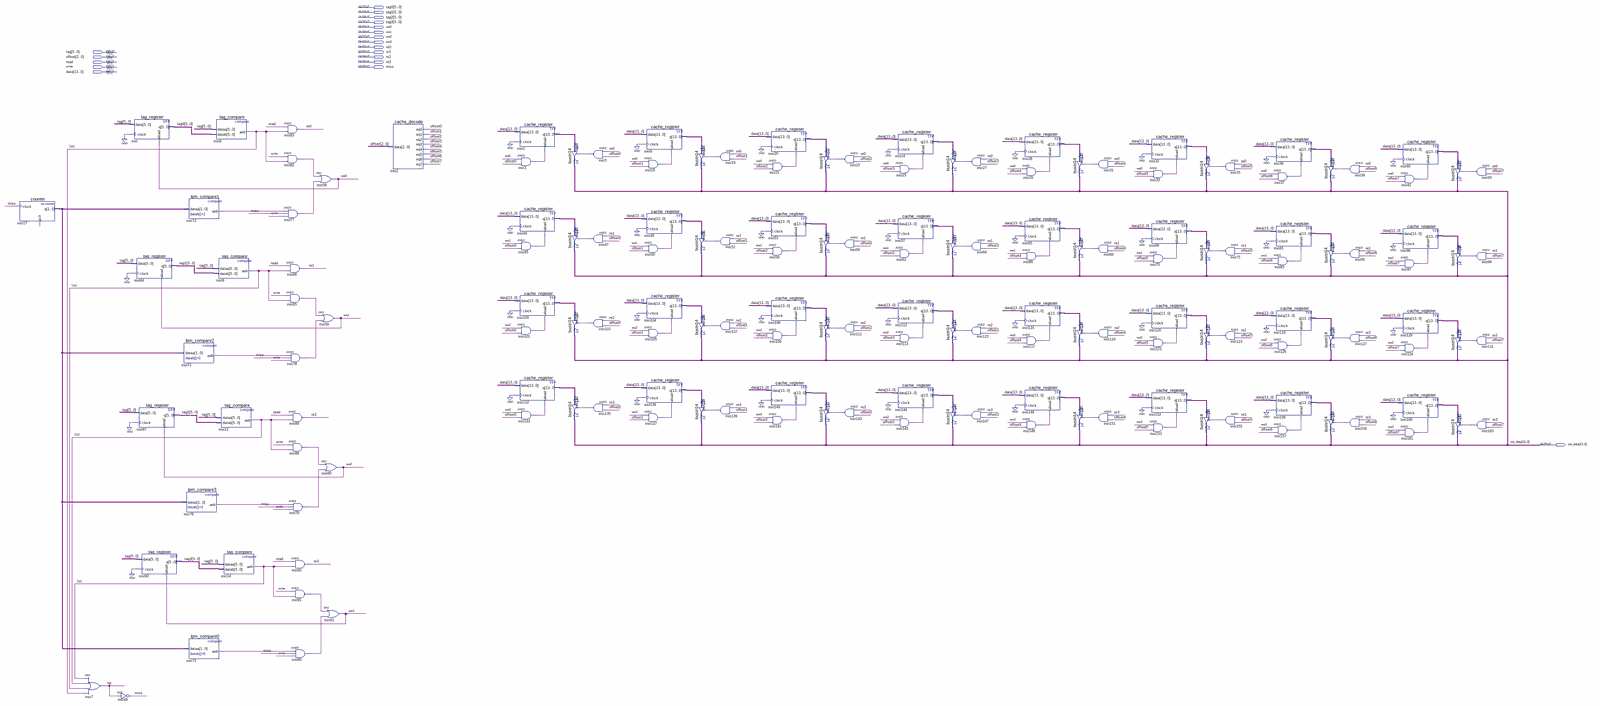
[diagram p0: schematic sheet, whole]
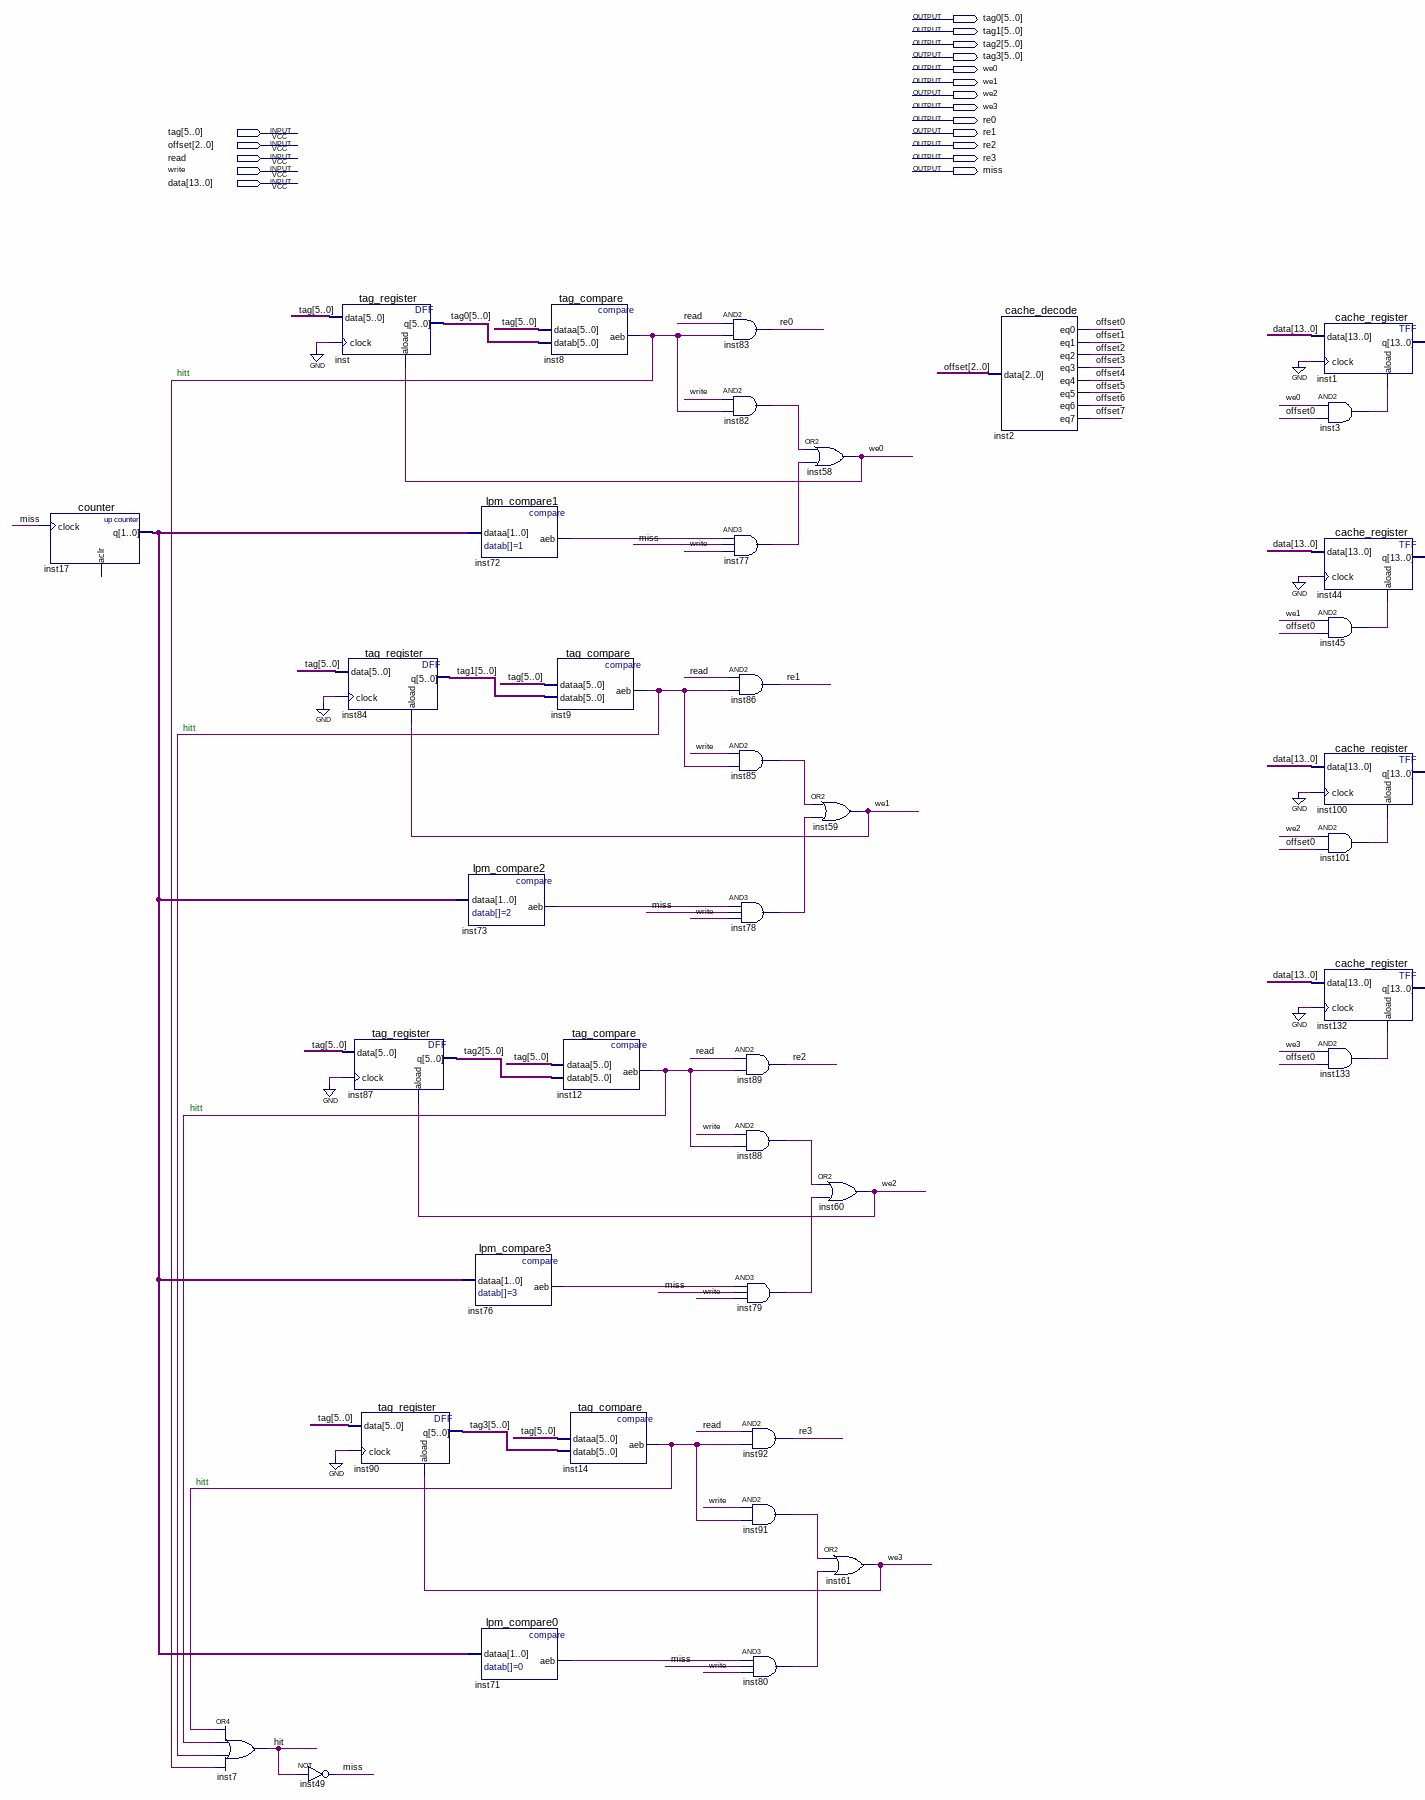
[diagram p1: schematic sheet, left part]
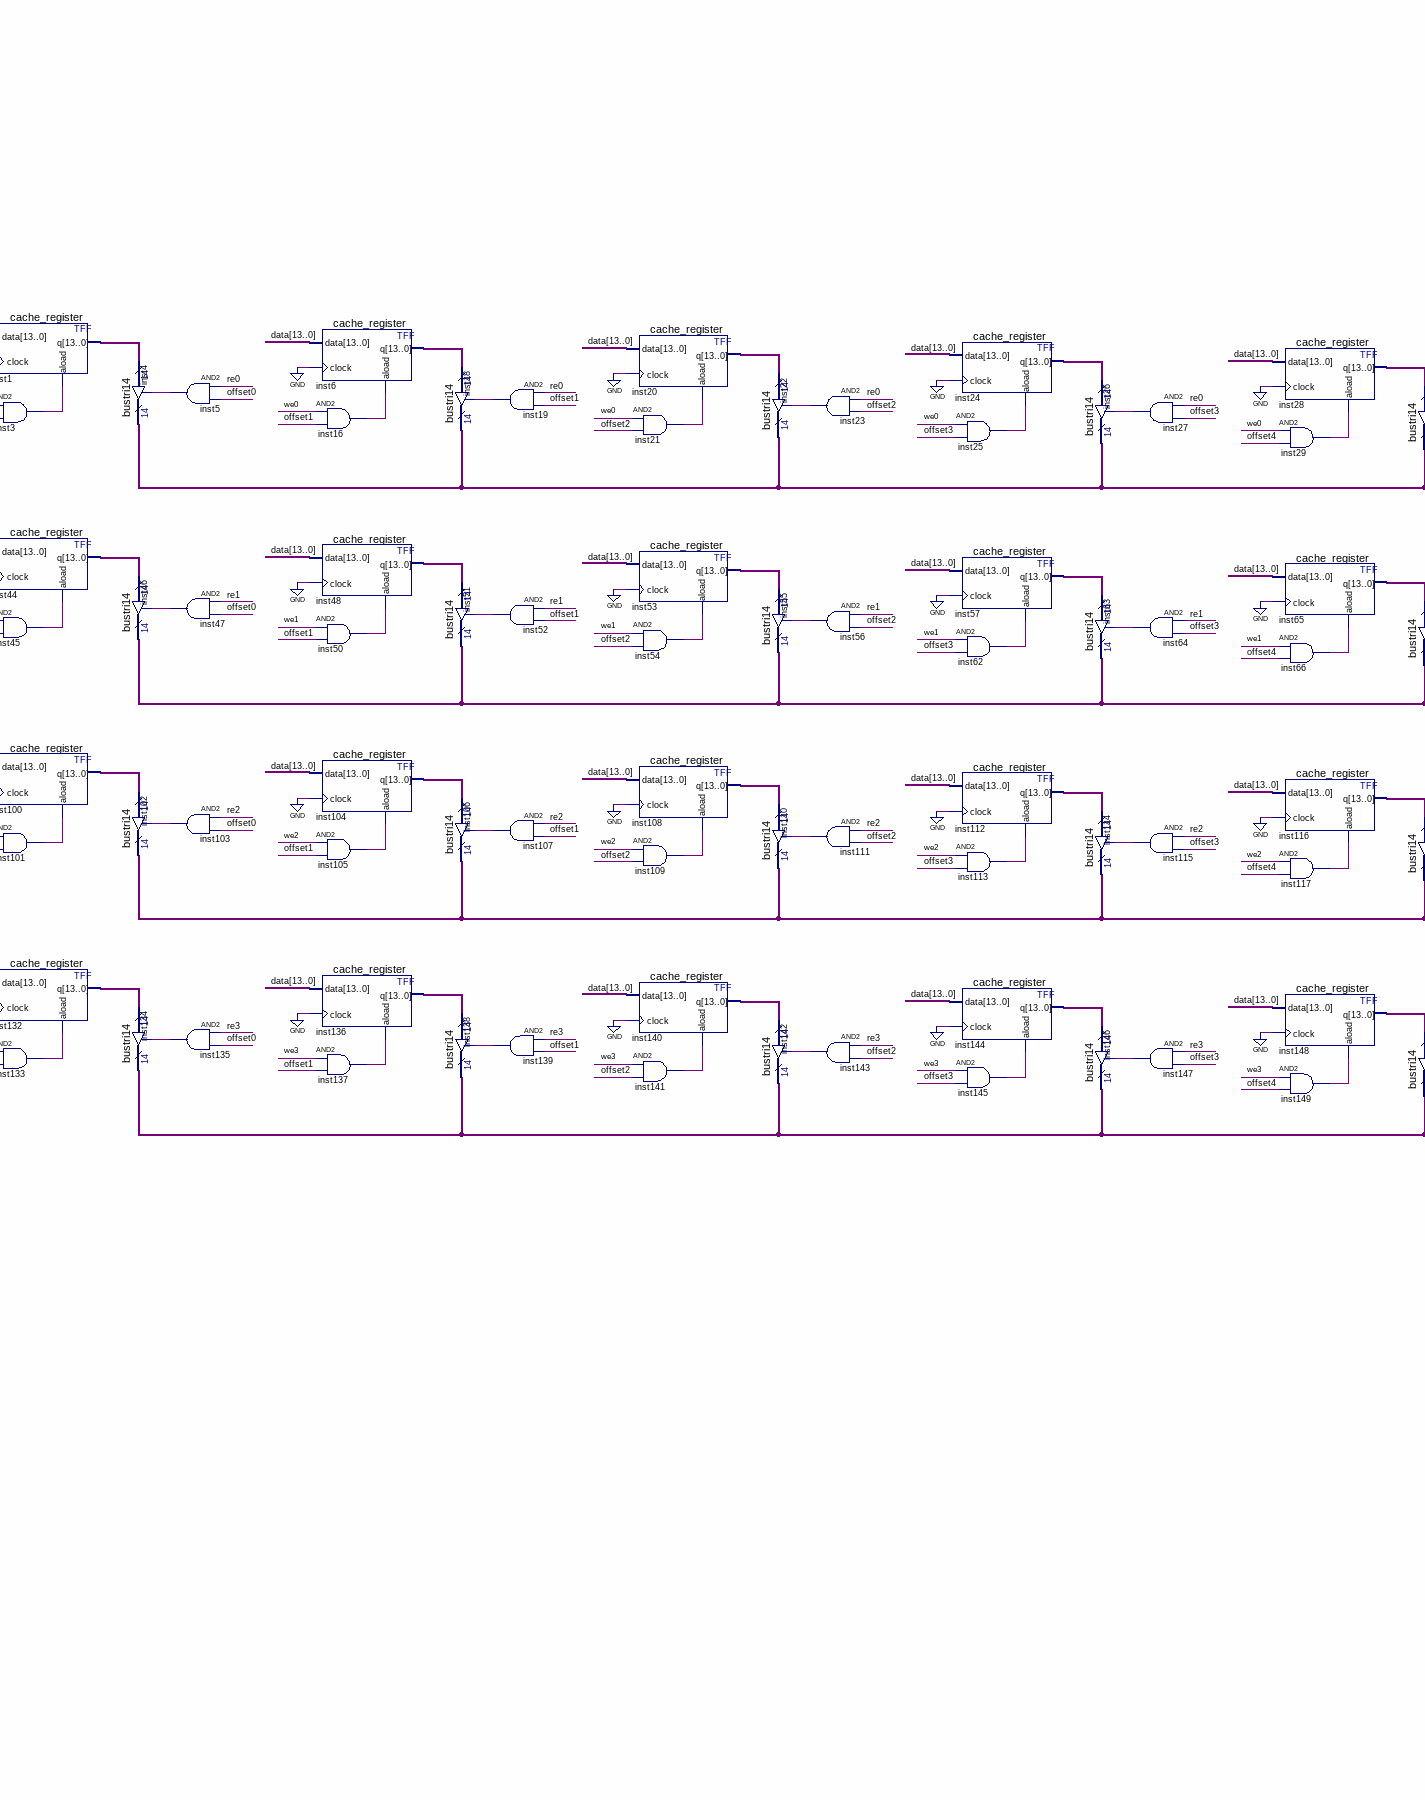
[diagram p2: schematic sheet, centre part]
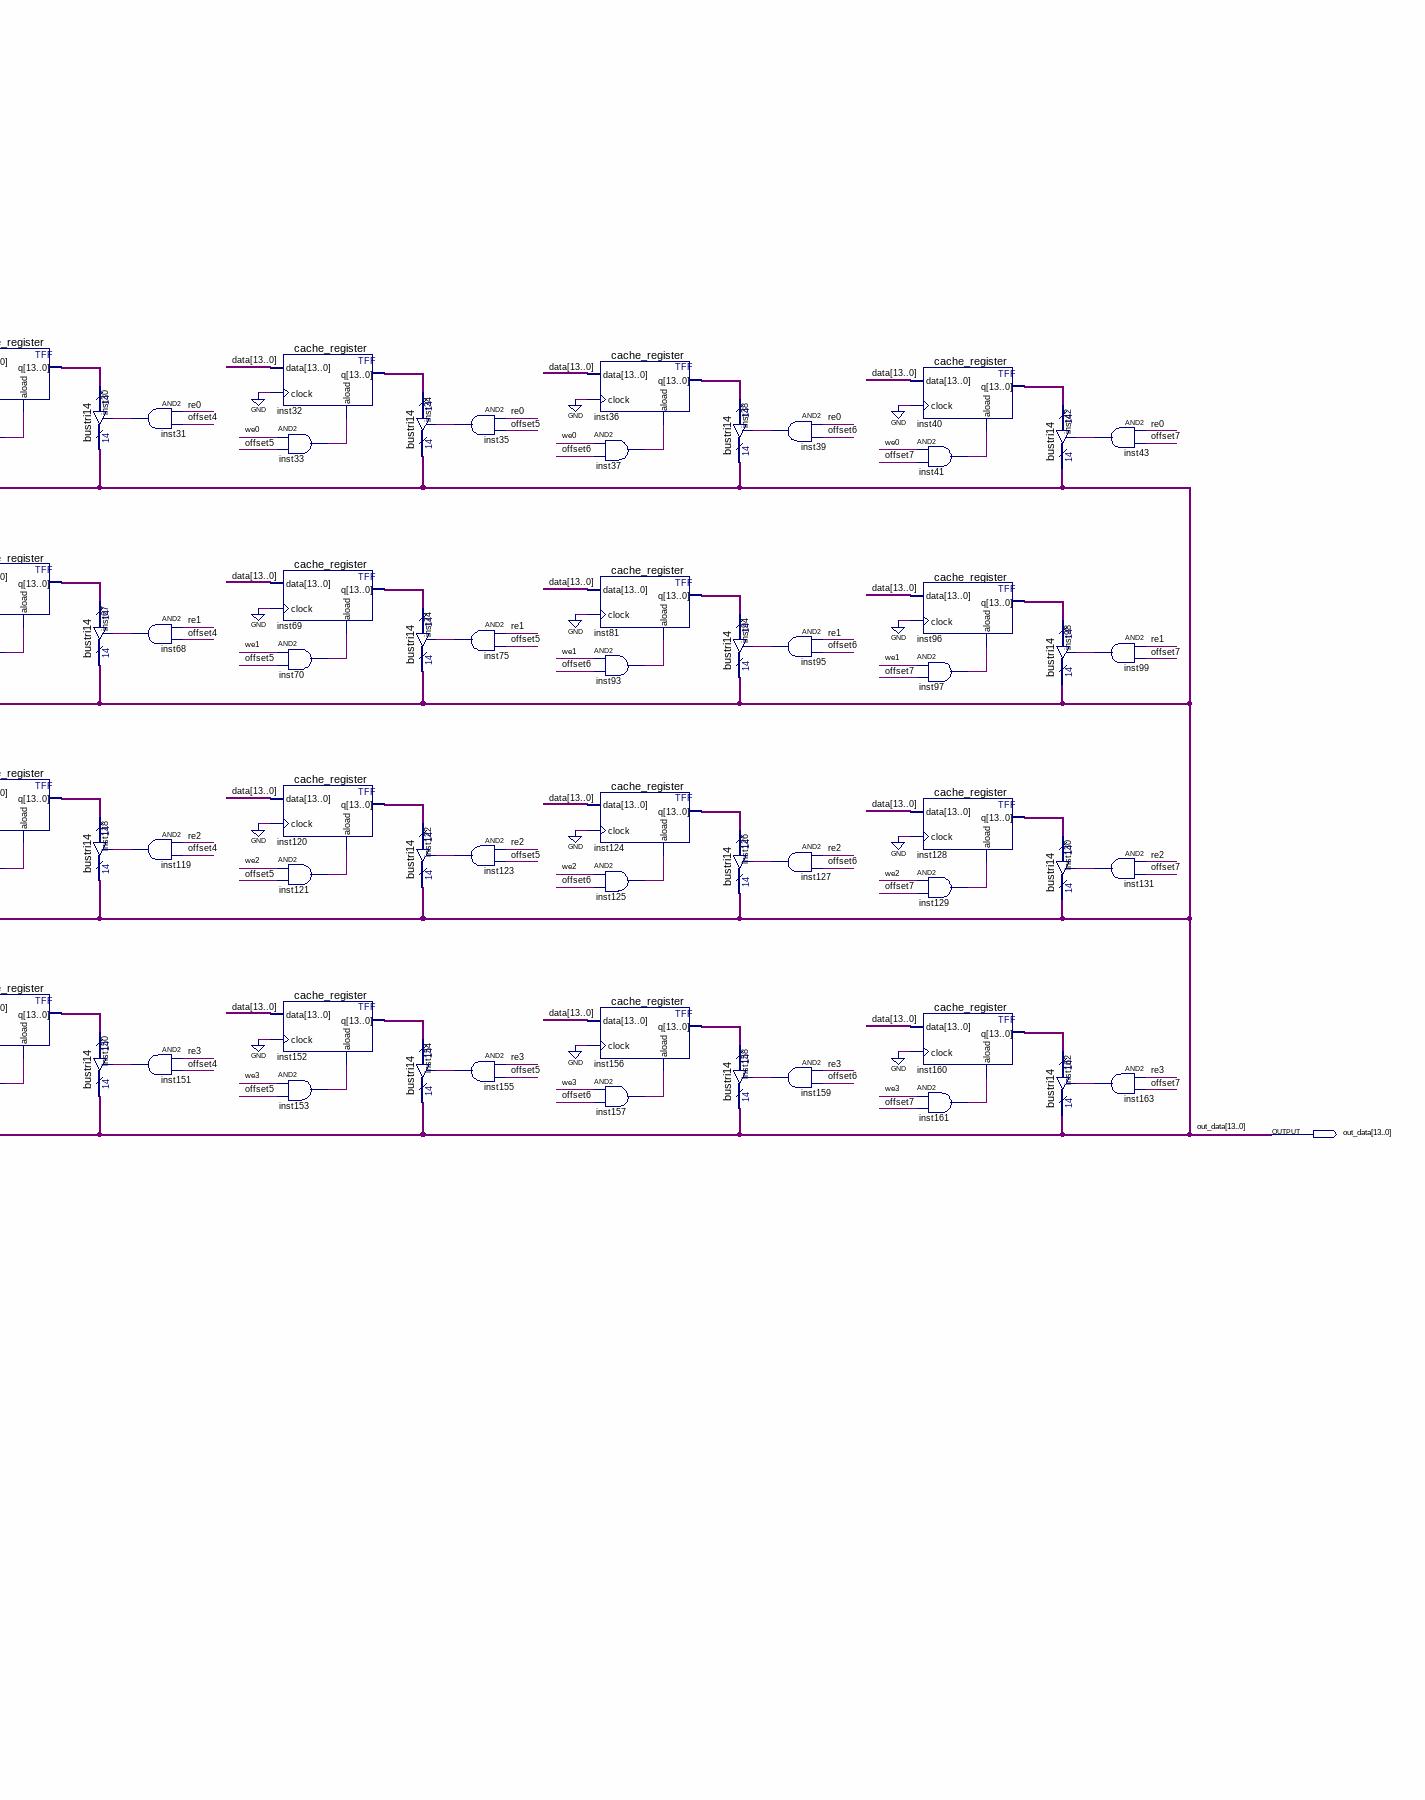
[diagram p3: schematic sheet, right part]
// Quartus schematic cachMem.bdf as structural Verilog: 160 symbols, 19 pins
module cachMem (
  input  [5:0] tag,
  input  [2:0] offset,
  input  read,
  input  write,
  input  [13:0] data,
  output [5:0] tag0,
  output [5:0] tag1,
  output [5:0] tag2,
  output [5:0] tag3,
  output we0,
  output we1,
  output we2,
  output we3,
  output re0,
  output re1,
  output re2,
  output re3,
  output miss,
  output [13:0] out_data
);

  wire hit, inst3_out, inst5_out, inst8_aeb, inst9_aeb, inst12_aeb, inst14_aeb, inst16_out, inst19_out,
       inst21_out, inst23_out, inst25_out, inst27_out, inst29_out, inst31_out, inst33_out, inst35_out,
       inst37_out, inst39_out, inst41_out, inst43_out, inst45_out, inst47_out, inst50_out, inst52_out,
       inst54_out, inst56_out, inst62_out, inst64_out, inst66_out, inst68_out, inst70_out, inst71_aeb,
       inst72_aeb, inst73_aeb, inst75_out, inst76_aeb, inst77_out, inst78_out, inst79_out, inst80_out,
       inst82_out, inst85_out, inst88_out, inst91_out, inst93_out, inst95_out, inst97_out, inst99_out,
       inst101_out, inst103_out, inst105_out, inst107_out, inst109_out, inst111_out, inst113_out,
       inst115_out, inst117_out, inst119_out, inst121_out, inst123_out, inst125_out, inst127_out,
       inst129_out, inst131_out, inst133_out, inst135_out, inst137_out, inst139_out, inst141_out,
       inst143_out, inst145_out, inst147_out, inst149_out, inst151_out, inst153_out, inst155_out,
       inst157_out, inst159_out, inst161_out, inst163_out, offset3, offset4, offset5, offset6, offset7;
  wire [1:0] inst17_q;
  wire [13:0] inst1_q, inst6_q, inst20_q, inst24_q, inst28_q, inst32_q, inst36_q, inst40_q, inst44_q,
       inst48_q, inst53_q, inst57_q, inst65_q, inst69_q, inst81_q, inst96_q, inst100_q, inst104_q, inst108_q,
       inst112_q, inst116_q, inst120_q, inst124_q, inst128_q, inst132_q, inst136_q, inst140_q, inst144_q,
       inst148_q, inst152_q, inst156_q, inst160_q;

  counter inst17 (.clock(miss), .q(inst17_q));  // open: aclr
  or inst7 (hit, inst14_aeb, inst12_aeb, inst9_aeb, inst8_aeb);
  tag_register inst (.data(tag), .clock(1'b0), .aload(we0), .q(tag0));
  tag_register inst84 (.data(tag), .clock(1'b0), .aload(we1), .q(tag1));
  not inst49 (miss, hit);
  tag_register inst87 (.data(tag), .clock(1'b0), .aload(we2), .q(tag2));
  tag_register inst90 (.data(tag), .clock(1'b0), .aload(we3), .q(tag3));
  lpm_compare1 inst72 (.dataa(inst17_q), .aeb(inst72_aeb));
  lpm_compare2 inst73 (.dataa(inst17_q), .aeb(inst73_aeb));
  lpm_compare3 inst76 (.dataa(inst17_q), .aeb(inst76_aeb));
  lpm_compare0 inst71 (.dataa(inst17_q), .aeb(inst71_aeb));
  tag_compare inst8 (.dataa(tag), .datab(tag0), .aeb(inst8_aeb));
  tag_compare inst9 (.dataa(tag), .datab(tag1), .aeb(inst9_aeb));
  tag_compare inst12 (.dataa(tag), .datab(tag2), .aeb(inst12_aeb));
  tag_compare inst14 (.dataa(tag), .datab(tag3), .aeb(inst14_aeb));
  and inst83 (re0, read, inst8_aeb);
  and inst82 (inst82_out, write, inst8_aeb);
  and inst77 (inst77_out, inst72_aeb, miss, write);
  and inst86 (re1, read, inst9_aeb);
  and inst85 (inst85_out, write, inst9_aeb);
  and inst78 (inst78_out, inst73_aeb, miss, write);
  and inst89 (re2, read, inst12_aeb);
  and inst88 (inst88_out, write, inst12_aeb);
  and inst79 (inst79_out, inst76_aeb, miss, write);
  and inst92 (re3, read, inst14_aeb);
  and inst91 (inst91_out, write, inst14_aeb);
  and inst80 (inst80_out, inst71_aeb, miss, write);
  or inst58 (we0, inst82_out, inst77_out);
  or inst59 (we1, inst85_out, inst78_out);
  or inst60 (we2, inst88_out, inst79_out);
  or inst61 (we3, inst91_out, inst80_out);
  cache_decode inst2 (
    .data(offset), .eq0(offset[0]), .eq1(offset[1]), .eq2(offset[2]), .eq3(offset3), .eq4(offset4),
    .eq5(offset5), .eq6(offset6), .eq7(offset7));
  cache_register inst1 (.data(data), .clock(1'b0), .aload(inst3_out), .q(inst1_q));
  and inst3 (inst3_out, we0, offset[0]);
  cache_register inst44 (.data(data), .clock(1'b0), .aload(inst45_out), .q(inst44_q));
  and inst45 (inst45_out, we1, offset[0]);
  cache_register inst100 (.data(data), .clock(1'b0), .aload(inst101_out), .q(inst100_q));
  and inst101 (inst101_out, we2, offset[0]);
  cache_register inst132 (.data(data), .clock(1'b0), .aload(inst133_out), .q(inst132_q));
  and inst133 (inst133_out, we3, offset[0]);
  bustri14 inst4 (.enabledt(inst5_out), .data(inst1_q), .tridata(out_data));
  bustri14 inst46 (.enabledt(inst47_out), .data(inst44_q), .tridata(out_data));
  bustri14 inst102 (.enabledt(inst103_out), .data(inst100_q), .tridata(out_data));
  bustri14 inst134 (.enabledt(inst135_out), .data(inst132_q), .tridata(out_data));
  and inst5 (inst5_out, re0, offset[0]);
  and inst47 (inst47_out, re1, offset[0]);
  and inst103 (inst103_out, re2, offset[0]);
  and inst135 (inst135_out, re3, offset[0]);
  cache_register inst6 (.data(data), .clock(1'b0), .aload(inst16_out), .q(inst6_q));
  and inst16 (inst16_out, we0, offset[1]);
  cache_register inst48 (.data(data), .clock(1'b0), .aload(inst50_out), .q(inst48_q));
  and inst50 (inst50_out, we1, offset[1]);
  cache_register inst104 (.data(data), .clock(1'b0), .aload(inst105_out), .q(inst104_q));
  and inst105 (inst105_out, we2, offset[1]);
  cache_register inst136 (.data(data), .clock(1'b0), .aload(inst137_out), .q(inst136_q));
  and inst137 (inst137_out, we3, offset[1]);
  bustri14 inst18 (.enabledt(inst19_out), .data(inst6_q), .tridata(out_data));
  bustri14 inst51 (.enabledt(inst52_out), .data(inst48_q), .tridata(out_data));
  bustri14 inst106 (.enabledt(inst107_out), .data(inst104_q), .tridata(out_data));
  bustri14 inst138 (.enabledt(inst139_out), .data(inst136_q), .tridata(out_data));
  and inst19 (inst19_out, re0, offset[1]);
  and inst52 (inst52_out, re1, offset[1]);
  and inst107 (inst107_out, re2, offset[1]);
  and inst139 (inst139_out, re3, offset[1]);
  cache_register inst20 (.data(data), .clock(1'b0), .aload(inst21_out), .q(inst20_q));
  and inst21 (inst21_out, we0, offset[2]);
  cache_register inst53 (.data(data), .clock(1'b0), .aload(inst54_out), .q(inst53_q));
  and inst54 (inst54_out, we1, offset[2]);
  cache_register inst108 (.data(data), .clock(1'b0), .aload(inst109_out), .q(inst108_q));
  and inst109 (inst109_out, we2, offset[2]);
  cache_register inst140 (.data(data), .clock(1'b0), .aload(inst141_out), .q(inst140_q));
  and inst141 (inst141_out, we3, offset[2]);
  bustri14 inst22 (.enabledt(inst23_out), .data(inst20_q), .tridata(out_data));
  bustri14 inst55 (.enabledt(inst56_out), .data(inst53_q), .tridata(out_data));
  bustri14 inst110 (.enabledt(inst111_out), .data(inst108_q), .tridata(out_data));
  bustri14 inst142 (.enabledt(inst143_out), .data(inst140_q), .tridata(out_data));
  and inst23 (inst23_out, re0, offset[2]);
  and inst56 (inst56_out, re1, offset[2]);
  and inst111 (inst111_out, re2, offset[2]);
  and inst143 (inst143_out, re3, offset[2]);
  cache_register inst24 (.data(data), .clock(1'b0), .aload(inst25_out), .q(inst24_q));
  and inst25 (inst25_out, we0, offset3);
  cache_register inst57 (.data(data), .clock(1'b0), .aload(inst62_out), .q(inst57_q));
  and inst62 (inst62_out, we1, offset3);
  cache_register inst112 (.data(data), .clock(1'b0), .aload(inst113_out), .q(inst112_q));
  and inst113 (inst113_out, we2, offset3);
  cache_register inst144 (.data(data), .clock(1'b0), .aload(inst145_out), .q(inst144_q));
  and inst145 (inst145_out, we3, offset3);
  bustri14 inst26 (.enabledt(inst27_out), .data(inst24_q), .tridata(out_data));
  bustri14 inst63 (.enabledt(inst64_out), .data(inst57_q), .tridata(out_data));
  bustri14 inst114 (.enabledt(inst115_out), .data(inst112_q), .tridata(out_data));
  bustri14 inst146 (.enabledt(inst147_out), .data(inst144_q), .tridata(out_data));
  and inst27 (inst27_out, re0, offset3);
  and inst64 (inst64_out, re1, offset3);
  and inst115 (inst115_out, re2, offset3);
  and inst147 (inst147_out, re3, offset3);
  cache_register inst28 (.data(data), .clock(1'b0), .aload(inst29_out), .q(inst28_q));
  and inst29 (inst29_out, we0, offset4);
  cache_register inst65 (.data(data), .clock(1'b0), .aload(inst66_out), .q(inst65_q));
  and inst66 (inst66_out, we1, offset4);
  cache_register inst116 (.data(data), .clock(1'b0), .aload(inst117_out), .q(inst116_q));
  and inst117 (inst117_out, we2, offset4);
  cache_register inst148 (.data(data), .clock(1'b0), .aload(inst149_out), .q(inst148_q));
  and inst149 (inst149_out, we3, offset4);
  bustri14 inst30 (.enabledt(inst31_out), .data(inst28_q), .tridata(out_data));
  bustri14 inst67 (.enabledt(inst68_out), .data(inst65_q), .tridata(out_data));
  bustri14 inst118 (.enabledt(inst119_out), .data(inst116_q), .tridata(out_data));
  bustri14 inst150 (.enabledt(inst151_out), .data(inst148_q), .tridata(out_data));
  and inst31 (inst31_out, re0, offset4);
  and inst68 (inst68_out, re1, offset4);
  and inst119 (inst119_out, re2, offset4);
  and inst151 (inst151_out, re3, offset4);
  cache_register inst32 (.data(data), .clock(1'b0), .aload(inst33_out), .q(inst32_q));
  cache_register inst69 (.data(data), .clock(1'b0), .aload(inst70_out), .q(inst69_q));
  cache_register inst120 (.data(data), .clock(1'b0), .aload(inst121_out), .q(inst120_q));
  cache_register inst152 (.data(data), .clock(1'b0), .aload(inst153_out), .q(inst152_q));
  and inst33 (inst33_out, we0, offset5);
  and inst70 (inst70_out, we1, offset5);
  and inst121 (inst121_out, we2, offset5);
  and inst153 (inst153_out, we3, offset5);
  bustri14 inst34 (.enabledt(inst35_out), .data(inst32_q), .tridata(out_data));
  bustri14 inst74 (.enabledt(inst75_out), .data(inst69_q), .tridata(out_data));
  bustri14 inst122 (.enabledt(inst123_out), .data(inst120_q), .tridata(out_data));
  bustri14 inst154 (.enabledt(inst155_out), .data(inst152_q), .tridata(out_data));
  and inst35 (inst35_out, re0, offset5);
  and inst75 (inst75_out, re1, offset5);
  and inst123 (inst123_out, re2, offset5);
  and inst155 (inst155_out, re3, offset5);
  cache_register inst36 (.data(data), .clock(1'b0), .aload(inst37_out), .q(inst36_q));
  and inst37 (inst37_out, we0, offset6);
  cache_register inst81 (.data(data), .clock(1'b0), .aload(inst93_out), .q(inst81_q));
  and inst93 (inst93_out, we1, offset6);
  cache_register inst124 (.data(data), .clock(1'b0), .aload(inst125_out), .q(inst124_q));
  and inst125 (inst125_out, we2, offset6);
  cache_register inst156 (.data(data), .clock(1'b0), .aload(inst157_out), .q(inst156_q));
  and inst157 (inst157_out, we3, offset6);
  bustri14 inst38 (.enabledt(inst39_out), .data(inst36_q), .tridata(out_data));
  bustri14 inst94 (.enabledt(inst95_out), .data(inst81_q), .tridata(out_data));
  bustri14 inst126 (.enabledt(inst127_out), .data(inst124_q), .tridata(out_data));
  bustri14 inst158 (.enabledt(inst159_out), .data(inst156_q), .tridata(out_data));
  and inst39 (inst39_out, re0, offset6);
  and inst95 (inst95_out, re1, offset6);
  and inst127 (inst127_out, re2, offset6);
  and inst159 (inst159_out, re3, offset6);
  cache_register inst40 (.data(data), .clock(1'b0), .aload(inst41_out), .q(inst40_q));
  and inst41 (inst41_out, we0, offset7);
  cache_register inst96 (.data(data), .clock(1'b0), .aload(inst97_out), .q(inst96_q));
  and inst97 (inst97_out, we1, offset7);
  cache_register inst128 (.data(data), .clock(1'b0), .aload(inst129_out), .q(inst128_q));
  and inst129 (inst129_out, we2, offset7);
  cache_register inst160 (.data(data), .clock(1'b0), .aload(inst161_out), .q(inst160_q));
  and inst161 (inst161_out, we3, offset7);
  bustri14 inst42 (.enabledt(inst43_out), .data(inst40_q), .tridata(out_data));
  bustri14 inst98 (.enabledt(inst99_out), .data(inst96_q), .tridata(out_data));
  bustri14 inst130 (.enabledt(inst131_out), .data(inst128_q), .tridata(out_data));
  bustri14 inst162 (.enabledt(inst163_out), .data(inst160_q), .tridata(out_data));
  and inst43 (inst43_out, re0, offset7);
  and inst99 (inst99_out, re1, offset7);
  and inst131 (inst131_out, re2, offset7);
  and inst163 (inst163_out, re3, offset7);

  // Notes on the sheet:
  //   hitt
  //   hitt
  //   hitt
  //   hitt
endmodule
